# EAGLE design uproszczony_odbiornik (EAGLE 7.7.0)
Uproszczony odbiornik e-czas.pl
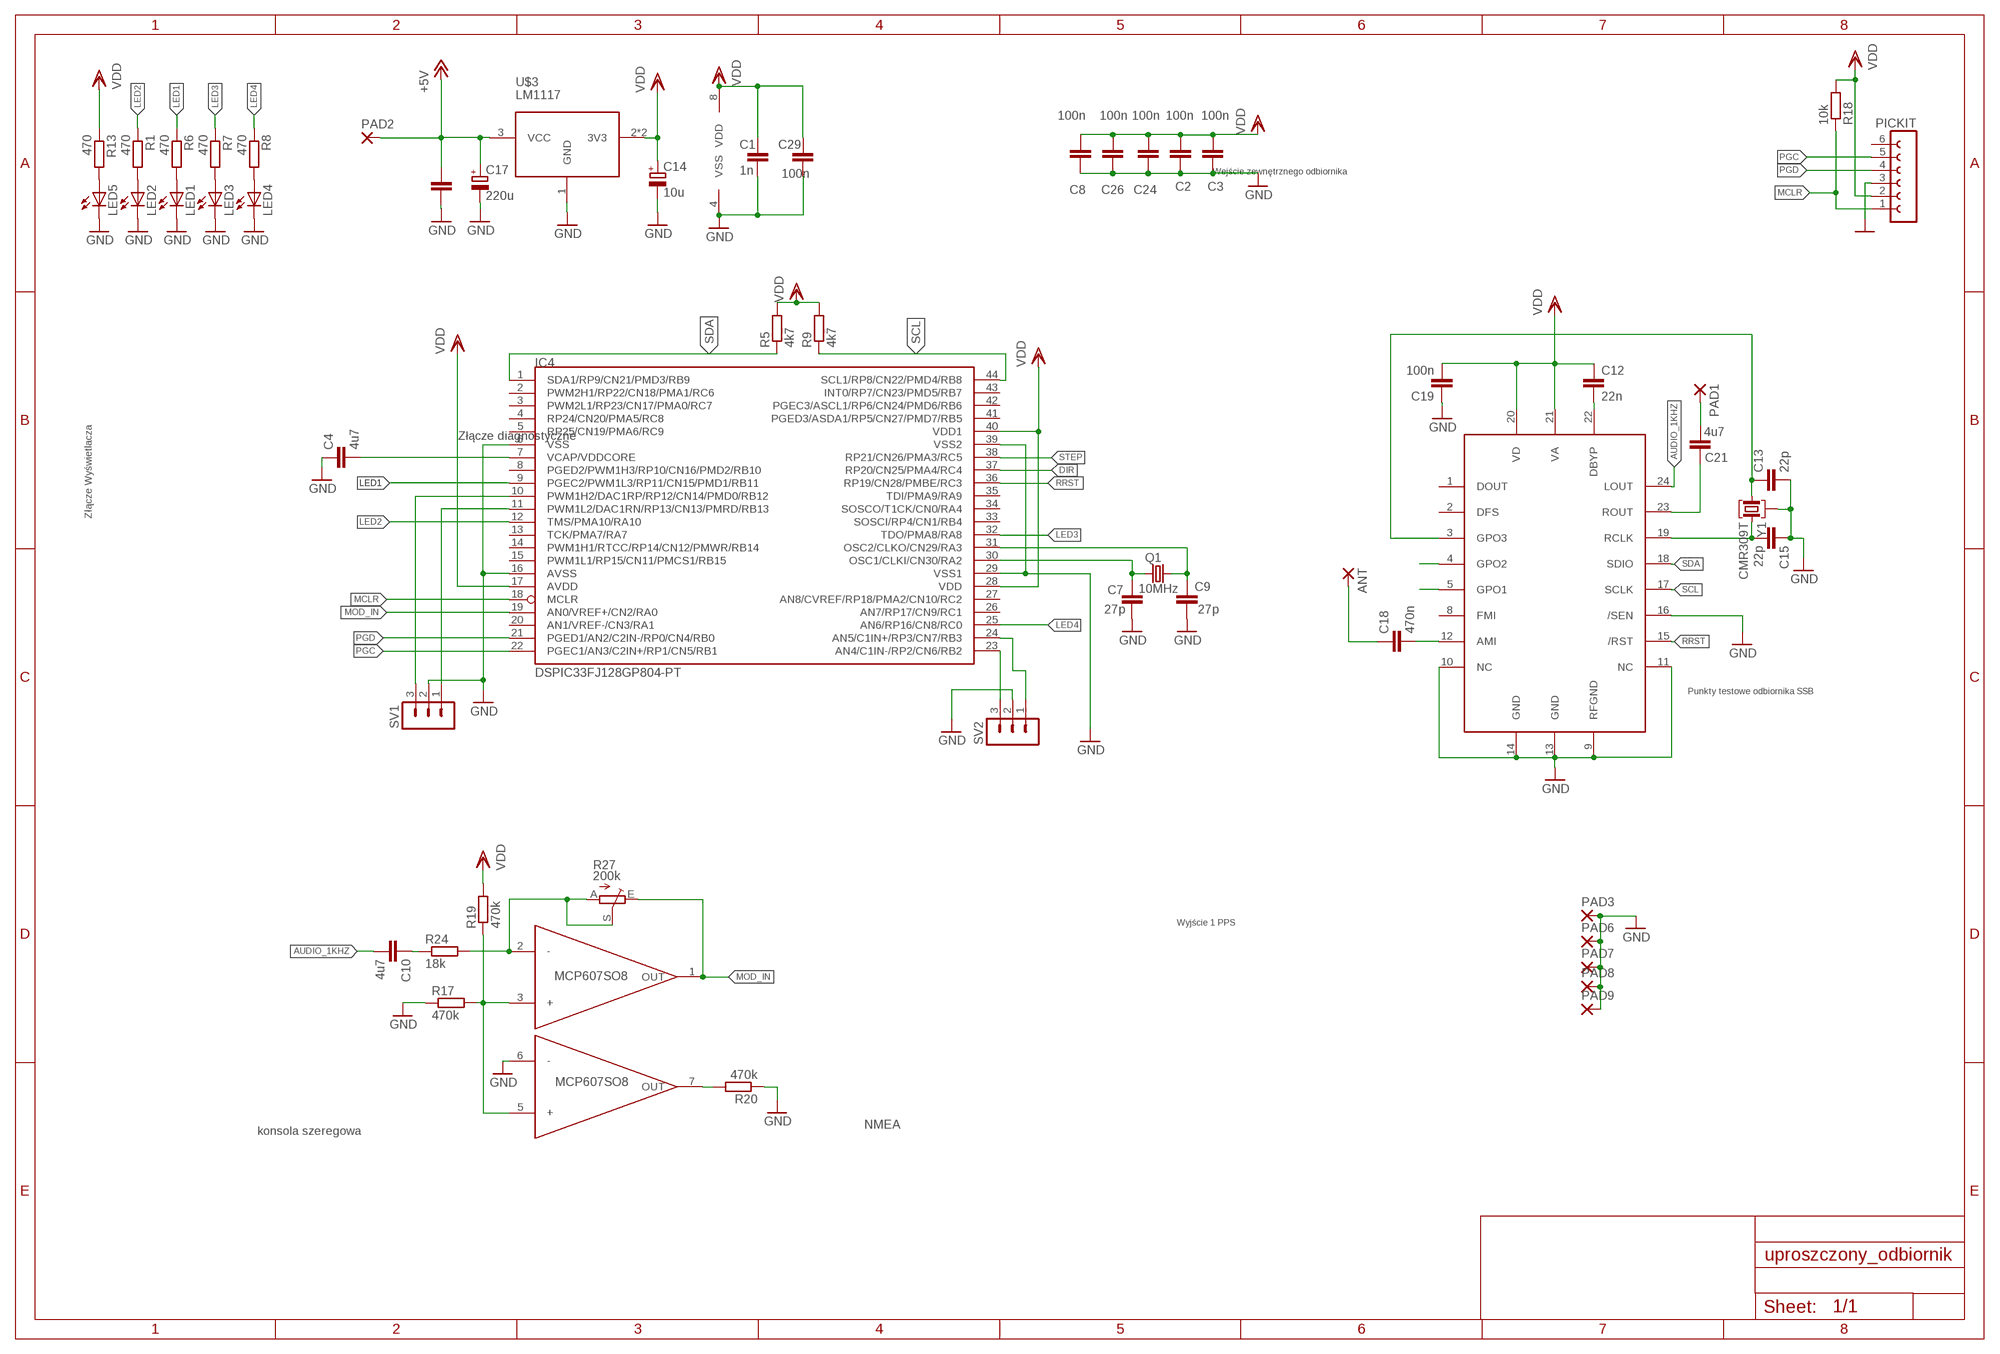
[diagram p0: schematic, sheet 1]
FRAME1 (A3L-LOC): AUTHOR: Tom SP9UOB

## Parts
ANT  1,6/0,9  [1,6/0,9]
C1  1n  C-EUC0805K  [C0805K]
C2  100n  C-EUC0805K  [C0805K]
C3  100n  C-EUC0805K  [C0805K]
C4  4u7  C-EUC0805K  [C0805K]
C5  100n  C-EUC0805K  [C0805K]
C7  27p  C-EUC0805K  [C0805K]
C8  100n  C-EUC0805K  [C0805K]
C9  27p  C-EUC0805K  [C0805K]
C10  4u7  C-EUC0603K  [C0603K]
C12  22n  C-EUC0603K  [C0603K]
C13  22p  C-EUC0603K  [C0603K]
C14  10u  CPOL-EUSMCB  [SMC_B]
C15  22p  C-EUC0603K  [C0603K]
C17  220u  CPOL-EUSMCB  [SMC_B]
C18  470n  C-EUC0603K  [C0603K]
C19  100n  C-EUC0603K  [C0603K]
C21  4u7  C-EUC0603K  [C0603K]
C24  100n  C-EUC0805K  [C0805K]
C26  100n  C-EUC0805K  [C0805K]
C29  100n  C-EUC0805K  [C0805K]
IC4  DSPIC33FJ128GP804-PT  DSPIC33FJ64MC804-PT  [TQFP44]
LED1  LEDCHIP-LED0805  [CHIP-LED0805]
LED2  LEDCHIP-LED0805  [CHIP-LED0805]
LED3  LEDCHIP-LED0805  [CHIP-LED0805]
LED4  LEDCHIP-LED0805  [CHIP-LED0805]
LED5  LEDCHIP-LED0805  [CHIP-LED0805]
PAD1  1,6/0,9  [1,6/0,9]
PAD2  1,6/0,9  [1,6/0,9]
PAD3  1,6/0,9  [1,6/0,9]
PAD6  1,6/0,9  [1,6/0,9]
PAD7  1,6/0,9  [1,6/0,9]
PAD8  1,6/0,9  [1,6/0,9]
PAD9  1,6/0,9  [1,6/0,9]
PICKIT  FE06-1  [FE06]
Q1  10MHz  CRYSTALHC49U-V  [HC49U-V]
R1  470  R-EU_R0805  [R0805]
R5  4k7  R-EU_R0805  [R0805]
R6  470  R-EU_R0805  [R0805]
R7  470  R-EU_R0805  [R0805]
R8  470  R-EU_R0805  [R0805]
R9  4k7  R-EU_R0805  [R0805]
R13  470  R-EU_R0805  [R0805]
R17  470k  R-EU_M0805  [M0805]
R18  10k  R-EU_R0805  [R0805]
R19  470k  R-EU_M0805  [M0805]
R20  470k  R-EU_M0805  [M0805]
R24  18k  R-EU_M0805  [M0805]
R27  200k  TRIM_EU-RJ9W  [RJ9W]
SV1  MA03-1  [MA03-1]
SV2  MA03-1  [MA03-1]
U$1  MCP607SO8  [SOIC8]
U$3  LM1117  [SOT223-3]
U$5  SI4735-D60  [SSOP24]
Y1  CMR309T  [CMR309T]

## Nets
10MHZ: C7.1 IC4.30(OSC1/CLKI/CN30/RA2) Q1.1
+5V: C5.1 C17.+ PAD2.1(P) U$3.3(VCC)
AUDIO_1KHZ: C10.2 U$5.24(LOUT)
CON_OUT: IC4.10(PWM1H2/DAC1RP/RP12/CN14/PMD0/RB12) SV1.3
CON_RX: IC4.11(PWM1L2/DAC1RN/RP13/CN13/PMRD/RB13) SV1.1
DBYP: C12.2 U$5.22(DBYP)
DIR: IC4.37(RP20/CN25/PMA4/RC4)
GND: C1.2 C2.2 C3.2 C4.1 C5.2 C7.2 C8.1 C9.2 C13.2 C14.- C15.1 C17.- C19.1 C24.1 C26.1 C29.2 IC4.6(VSS) IC4.16(AVSS) IC4.29(VSS1) IC4.39(VSS2) LED1.C LED2.C LED3.C LED4.C LED5.C PAD3.1(P) PAD6.1(P) PAD7.1(P) PAD8.1(P) PAD9.1(P) PICKIT.3 R17.1 R20.1 SV1.2 SV2.2 U$1.4(VSS) U$1.6(-) U$3.1(GND) U$5.9(RFGND) U$5.10(NC) U$5.11(NC) U$5.13(GND) U$5.14(GND) U$5.16(/SEN) Y1.3(G)
GPO1: U$5.5(GPO1)
GPO2: U$5.4(GPO2)
GPO3: C13.1 U$5.3(GPO3) Y1.1
LED1: IC4.9(PGEC2/PWM1L3/RP11/CN15/PMD1/RB11) R6.1
LED2: IC4.12(TMS/PMA10/RA10) R1.1
LED3: IC4.32(TDO/PMA8/RA8) R7.1
LED4: IC4.25(AN6/RP16/CN8/RC0) R8.1
MCLR: IC4.18(MCLR) PICKIT.1 R18.1
MOD_IN: IC4.19(AN0/VREF+/CN2/RA0) R27.E U$1.1(OUT)
N$1: LED2.A R1.2
N$2: R20.2 U$1.7(OUT)
N$3: C9.1 IC4.31(OSC2/CLKO/CN29/RA3) Q1.2
N$4: C21.2 PAD1.1(P)
N$6: ANT.1(P) C18.1
N$11: R17.2 R19.1 U$1.3(+) U$1.5(+)
N$12: R24.2 R27.A R27.S U$1.2(-)
N$17: LED3.A R7.2
N$18: LED4.A R8.2
N$19: LED1.A R6.2
N$20: C18.2 U$5.12(AMI)
N$45: C10.1 R24.1
N$47: LED5.A R13.2
NMEA_RX: IC4.23(AN4/C1IN-/RP2/CN6/RB2) SV2.3
NMEA_TX: IC4.24(AN5/C1IN+/RP3/CN7/RB3) SV2.1
PGC: IC4.22(PGEC1/AN3/C2IN+/RP1/CN5/RB1) PICKIT.5
PGD: IC4.21(PGED1/AN2/C2IN-/RP0/CN4/RB0) PICKIT.4
RCLK: C15.2 U$5.19(RCLK) Y1.2
ROUT: C21.1 U$5.23(ROUT)
RRST: IC4.36(RP19/CN28/PMBE/RC3) U$5.15(/RST)
SCL: IC4.44(SCL1/RP8/CN22/PMD4/RB8) R9.1 U$5.17(SCLK)
SDA: IC4.1(SDA1/RP9/CN21/PMD3/RB9) R5.1 U$5.18(SDIO)
STEP: IC4.38(RP21/CN26/PMA3/RC5)
VCAP/VDDCORE: C4.2 IC4.7(VCAP/VDDCORE)
VDD: C1.1 C2.1 C3.1 C8.2 C12.1 C14.+ C19.2 C24.2 C26.2 C29.1 IC4.17(AVDD) IC4.28(VDD) IC4.40(VDD1) PICKIT.2 R5.2 R9.2 R13.1 R18.2 R19.2 U$1.8(VDD) U$3.2(3V3) U$3.4(3V3) U$5.20(VD) U$5.21(VA)
Unconnected: IC4.2(PWM2H1/RP22/CN18/PMA1/RC6) IC4.3(PWM2L1/RP23/CN17/PMA0/RC7) IC4.4(RP24/CN20/PMA5/RC8) IC4.5(RP25/CN19/PMA6/RC9) IC4.8(PGED2/PWM1H3/RP10/CN16/PMD2/RB10) IC4.13(TCK/PMA7/RA7) IC4.14(PWM1H1/RTCC/RP14/CN12/PMWR/RB14) IC4.15(PWM1L1/RP15/CN11/PMCS1/RB15) IC4.20(AN1/VREF-/CN3/RA1) IC4.26(AN7/RP17/CN9/RC1) IC4.27(AN8/CVREF/RP18/PMA2/CN10/RC2) IC4.33(SOSCI/RP4/CN1/RB4) IC4.34(SOSCO/T1CK/CN0/RA4) IC4.35(TDI/PMA9/RA9) IC4.41(PGED3/ASDA1/RP5/CN27/PMD7/RB5) IC4.42(PGEC3/ASCL1/RP6/CN24/PMD6/RB6) IC4.43(INT0/RP7/CN23/PMD5/RB7) PICKIT.6 U$5.1(DOUT) U$5.2(DFS) U$5.8(FMI)

## Notes on the sheet
- Wejście zewnętrznego odbiornika
- Złącze diagnostyczne
- Złącze Wyświetlacza
- Punkty testowe odbiornika SSB
- Wyjście 1 PPS
- NMEA
- konsola szeregowa

## Library data of the parts
ANT PAD1-PAD3 PAD6-PAD9 = wirepad:1,6/0,9: THROUGH-HOLE PAD
C1-C5 C7-C10 C12 C13 C15 C18 C19 C21 C24 C26 C29 = rcl:C-EU: CAPACITOR, European symbol
C14 C17 = rcl:CPOL-EU: POLARIZED CAPACITOR, European symbol
IC4 = microchip-dspic33fjxxmc:DSPIC33FJ64MC804: dsPIC33FJ32MC302/304, dsPIC33FJ64MCX02/X04, AND dsPIC33FJ128MCX02/X04 High-Performance, 16-bit Digital Signal Controllers Package:44 Pin TQFP Operating Range: * Up to 40 MIPS operation (at 3.0V -3.6V): - Industrial temperature range (-40°C to +85°C) - Extended temperature range (-40°C to +125°C) High-Performance DSC CPU: * Modified Harvard architecture * C compiler optimized instruction set * 16-bit wide data path * 24-bit wide instructions * Linear program memory addressing up to 4M instruction words * Linear data memory addressing up to 64 Kbytes * 83 base instructions: mostly 1 word/1 cycle * Two 40-bit accumulators with rounding and saturation options * Flexible and powerful addressing modes: - Indirect - Modulo - Bit-Reversed * Software stack * 16 x 16 fractional/integer multiply operations * 32/16 and 16/16 divide operations * Single-cycle multiply and accumulate: - Accumulator write back for DSP operations - Dual data fetch * Up to ±16-bit shifts for up to 40-bit data Direct Memory Access (DMA): * 8-channel hardware DMA * Up to 2 Kbytes dual ported DMA buffer area (DMA RAM) to store data transferred via DMA: - Allows data transfer between RAM and a peripheral while CPU is executing code (no cycle stealing) * Most peripherals support DMA Timers/Capture/Compare/PWM: * Timer/Counters, up to five 16-bit timers: - Can pair up to make two 32-bit timers - One timer runs as a Real-Time Clock with an external 32.768 kHz oscillator - Programmable prescaler * Input Capture (up to four channels): - Capture on up, down or both edges - 16-bit capture input functions - 4-deep FIFO on each capture * Output Compare (up to four channels): - Single or Dual 16-bit Compare mode - 16-bit Glitchless PWM mode * Hardware Real-Time Clock/Calendar (RTCC): - Provides clock, calendar, and alarm functions Interrupt Controller: * 5-cycle latency * Up to 53 available interrupt sources * Up to three external interrupts * Seven programmable priority levels * Five processor exceptions Digital I/O: * Peripheral pin Select functionality * Up to 35 programmable digital I/O pins * Wake-up/Interrupt-on-Change for up to 31 pins * Output pins can drive from 3.0V to 3.6V * Up to 5V output with open drain configuration * All digital input pins are 5V tolerant * 4 mA sink on all I/O pins On-Chip Flash and SRAM: * Flash program memory (up to 128 Kbytes) * Data SRAM (up to 16 Kbytes) * Boot, Secure, and General Security for program Flash System Management: * Flexible clock options: - External, crystal, resonator, internal RC - Fully integrated Phase-Locked Loop (PLL) - Extremely low jitter PLL * Power-up Timer * Oscillator Start-up Timer/Stabilizer * Watchdog Timer with its own RC oscillator * Fail-Safe Clock Monitor * Reset by multiple sources Power Management: * On-chip 2.5V voltage regulator * Switch between clock sources in real time * Idle, Sleep, and Doze modes with fast wake-up Analog-to-Digital Converters (ADCs): * 10-bit, 1.1 Msps or 12-bit, 500 Ksps conversion: - Two and four simultaneous samples (10-bit ADC) - Up to nine input channels with auto-scanning - Conversion start can be manual or synchronized with one of four trigger sources - Conversion possible in Sleep mode - ±2 LSb max integral nonlinearity - ±1 LSb max differential nonlinearity Audio Digital-to-Analog Converter (DAC): - 16-bit Dual Channel DAC module - 100 Ksps maximum sampling rate - Second-Order Digital Delta-Sigma Modulator Comparator Module: * Two analog comparators with programmable input/output configuration CMOS Flash Technology: * Low-power, high-speed Flash technology * Fully static design * 3.3V (±10%) operating voltage * Industrial and Extended temperature * Low power consumption Motor Control Peripherals: * 6-channel 16-bit Motor Control PWM: - Three duty cycle generators - Independent or Complementary mode - Programmable dead-time and output polarity - Edge-aligned or center-aligned - Manual output override control - One Fault input - Trigger for ADC conversions - PWM frequency for 16-bit resolution (@ 40 MIPS) = 1220 Hz for Edge-Aligned mode, 610 Hz for Center-Aligned mode - PWM frequency for 11-bit resolution (@ 40 MIPS) = 39.1 kHz for Edge-Aligned mode, 19.55 kHz for Center-Aligned mode * 2-channel 16-bit Motor Control PWM: - One duty cycle generator - Independent or Complementary mode - Programmable dead time and output polarity - Edge-aligned or center-aligned - Manual output override control - One Fault input - Trigger for ADC conversions - PWM frequency for 16-bit resolution (@ 40 MIPS) = 1220 Hz for Edge-Aligned mode, 610 Hz for Center-Aligned mode - PWM frequency for 11-bit resolution (@ 40 MIPS) = 39.1 kHz for Edge-Aligned mode, 19.55 kHz for Center-Aligned mode * 2-Quadrature Encoder Interface module: - Phase A, Phase B, and index pulse input - 16-bit up/down position counter - Count direction status - Position Measurement (x2 and x4) mode - Programmable digital noise filters on inputs - Alternate 16-bit Timer/Counter mode - Interrupt on position counter rollover/underflow
LED1-LED5 = led:LED: LED OSRAM: - CHIPLED LG R971, LG N971, LY N971, LG Q971, LY Q971, LO R971, LY R971 LH N974, LH R974 LS Q976, LO Q976, LY Q976 LO Q996 - Hyper CHIPLED LW Q18S LB Q993, LB Q99A, LB R99A - SideLED LS A670, LO A670, LY A670, LG A670, LP A670 LB A673, LV A673, LT A673, LW A673 LH A674 LY A675 LS A676, LA A676, LO A676, LY A676, LW A676 LS A679, LY A679, LG A679 - Hyper Micro SIDELED® LS Y876, LA Y876, LO Y876, LY Y876 LT Y87S - SmartLED LW L88C, LW L88S LB L89C, LB L89S, LG L890 LS L89K, LO L89K, LY L89K LS L896, LA L896, LO L896, LY L896 - TOPLED LS T670, LO T670, LY T670, LG T670, LP T670 LSG T670, LSP T670, LSY T670, LOP T670, LYG T670 LG T671, LOG T671, LSG T671 LB T673, LV T673, LT T673, LW T673 LH T674 LS T676, LA T676, LO T676, LY T676, LB T676, LH T676, LSB T676, LW T676 LB T67C, LV T67C, LT T67C, LS T67K, LO T67K, LY T67K, LW E67C LS E67B, LA E67B, LO E67B, LY E67B, LB E67C, LV E67C, LT E67C LW T67C LS T679, LY T679, LG T679 LS T770, LO T770, LY T770, LG T770, LP T770 LB T773, LV T773, LT T773, LW T773 LH T774 LS E675, LA E675, LY E675, LS T675 LS T776, LA T776, LO T776, LY T776, LB T776 LHGB T686 LT T68C, LB T68C - Hyper Mini TOPLED® LB M676 - Mini TOPLED Santana® LG M470 LS M47K, LO M47K, LY M47K Source: http://www.osram.convergy.de LUXEON: - LUMILED® LXK2-PW12-R00, LXK2-PW12-S00, LXK2-PW14-U00, LXK2-PW14-V00 LXK2-PM12-R00, LXK2-PM12-S00, LXK2-PM14-U00 LXK2-PE12-Q00, LXK2-PE12-R00, LXK2-PE12-S00, LXK2-PE14-T00, LXK2-PE14-U00 LXK2-PB12-K00, LXK2-PB12-L00, LXK2-PB12-M00, LXK2-PB14-N00, LXK2-PB14-P00, LXK2-PB14-Q00 LXK2-PR12-L00, LXK2-PR12-M00, LXK2-PR14-Q00, LXK2-PR14-R00 LXK2-PD12-Q00, LXK2-PD12-R00, LXK2-PD12-S00 LXK2-PH12-R00, LXK2-PH12-S00 LXK2-PL12-P00, LXK2-PL12-Q00, LXK2-PL12-R00 Source: www.luxeon.com KINGBRIGHT: KA-3528ASYC Source: www.kingbright.com
PICKIT = con-lsta:FE06-1: FEMALE HEADER; OC_FARNELL: unknown; OC_NEWARK: unknown
Q1 = crystal:CRYSTAL: CRYSTAL; OC_FARNELL: 1666969; OC_NEWARK: unknown
R1 R5-R9 R13 R17-R20 R24 = rcl:R-EU_: RESISTOR, European symbol
R27 = pot:TRIM_EU-: POTENTIOMETER
SV1 SV2 = con-lstb:MA03-1: PIN HEADER; OC_FARNELL: unknown; OC_NEWARK: unknown
U$1 = vx:MCP607
U$3 = vx:LM1117
U$5 = vx:SI4735-D60
Y1 = crystal:CMR309T: CRYSTAL Citizen CMR309T Series

## Board
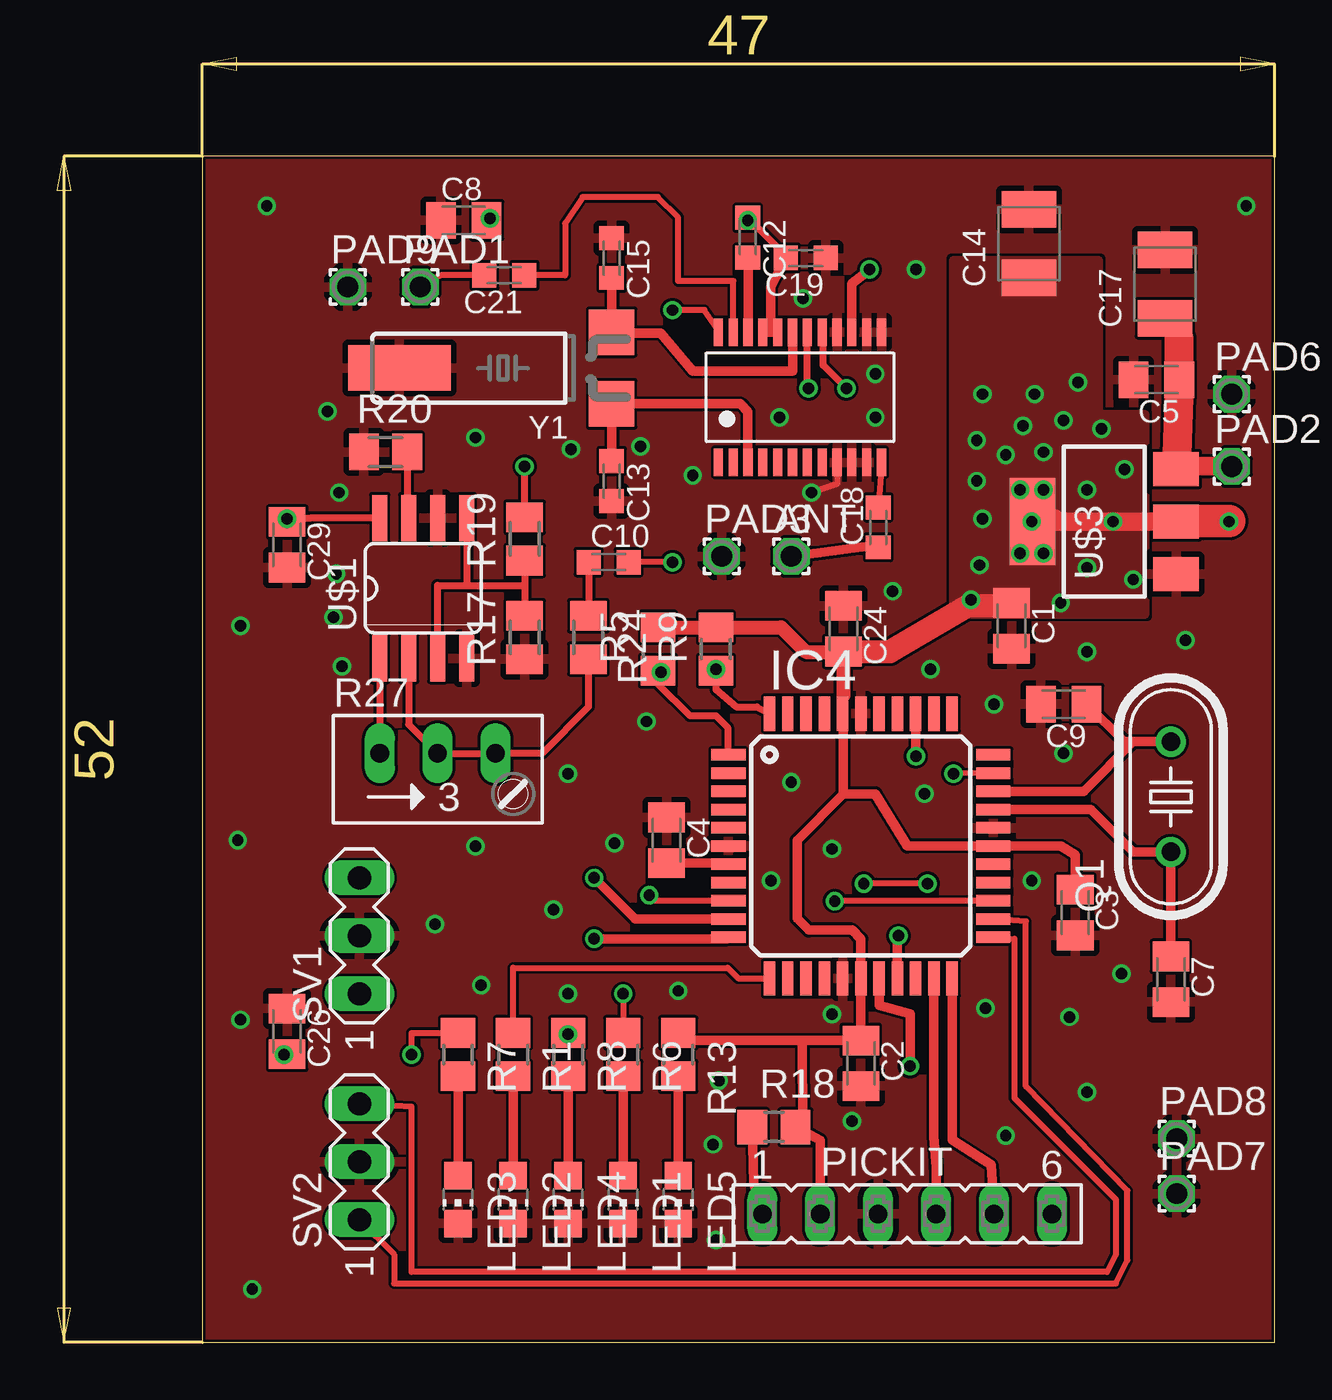
[diagram p1: board, top side]
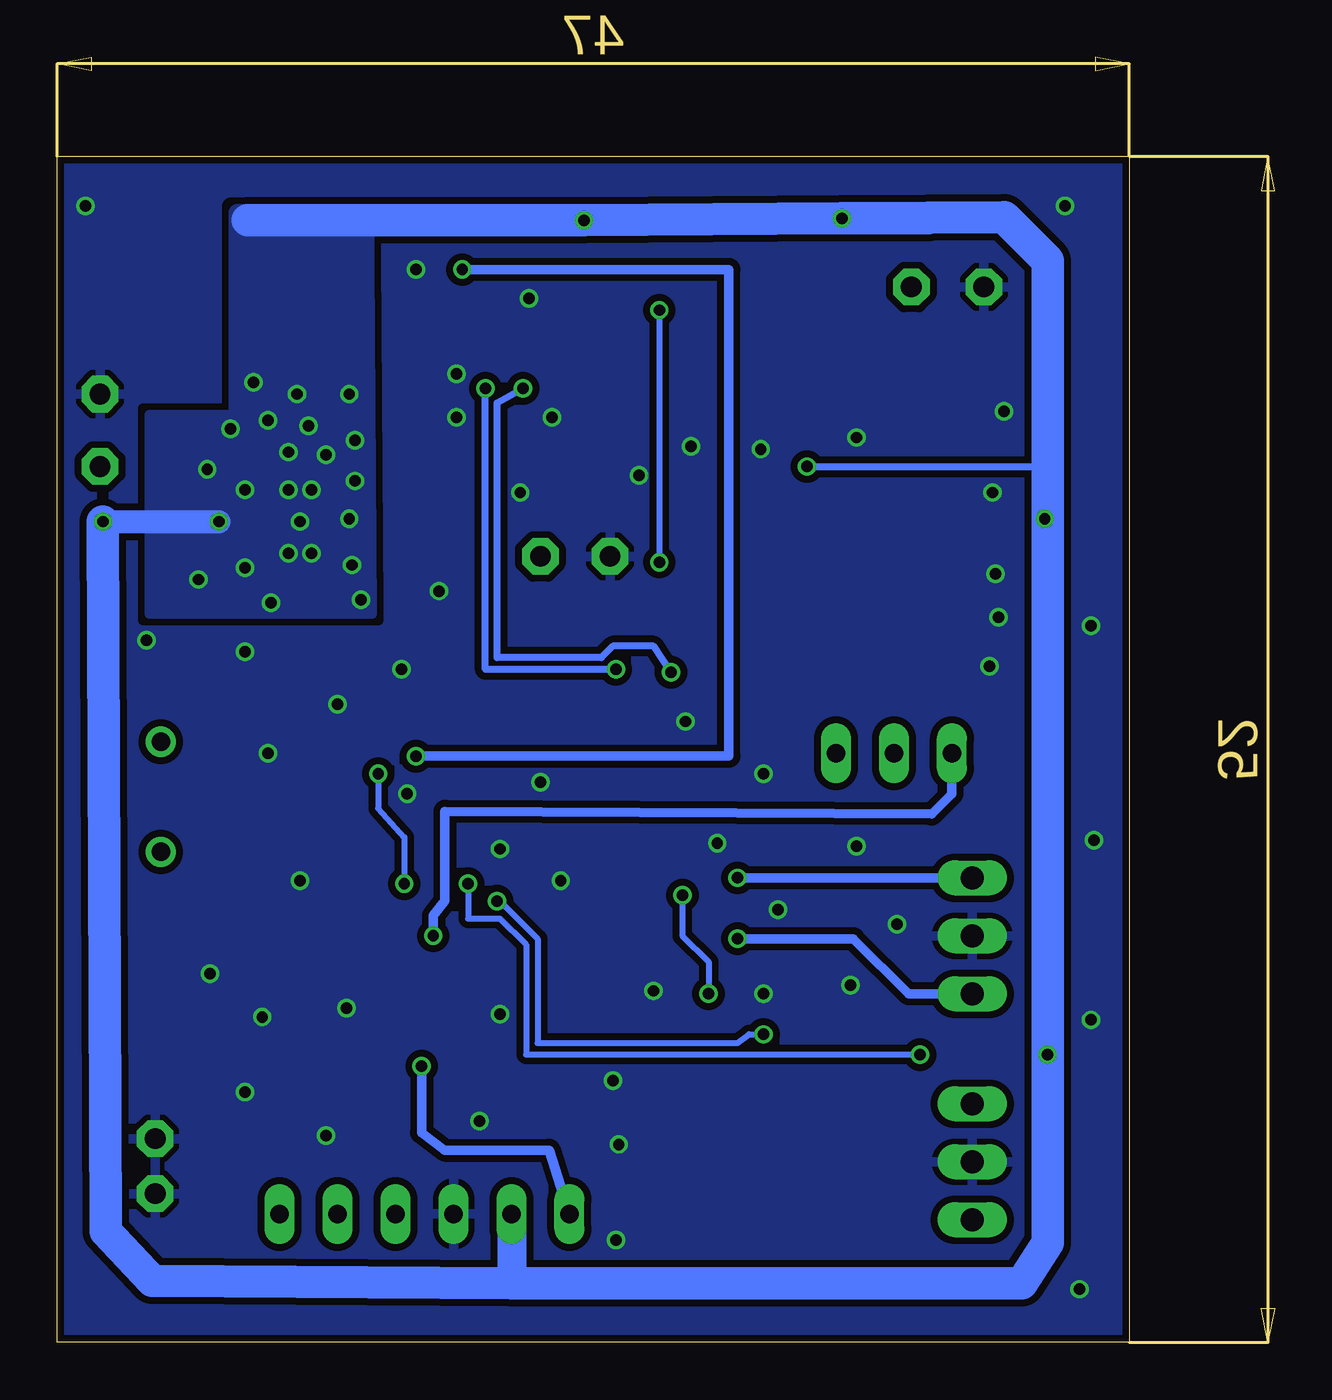
[diagram p2: board, bottom side, seen from below]

Size 47 x 52 mm. Coordinates in mm from the lower left corner, seen from the top.
Outline: 0,0 47,0 47,52 0,52 0,0
Copper layers (1*16): Top 0.035mm / dielectric 1.5mm / Bottom 0.035mm
Design rules "jlcpcb": minimum track width 5mil, minimum drill 0.25mm, track to track 5mil, track to pad 5mil, pad to pad 5mil, via to via 5mil, smd to smd 0mil, copper to edge 5mil, drill to drill 6mil, minimum pad ring 10mil, minimum via ring 6mil, stop-mask expansion 2mil, vias tented up to drill 100mil, thermal gap 10mil

### Footprints (pad centres in the part's own frame; a part is rotated, then mirrored left to right if it is on the bottom)
1,6/0,9 = drill 0.914 pad 1.6 octagon: 1 0,0
C0805K = smd 1.3 x 1.6: 1 -1,0; 2 1,0
C0603K = smd 1.05 x 1.08: 1 -0.875,0; 2 0.875,0
SMC_B = smd 1.6 x 2.4: + -1.5,0; - 1.5,0
TQFP44 = smd 1.5 x 0.5: 1 -5.8,4; 2 -5.8,3.2; 3 -5.8,2.4; 4 -5.8,1.6; 5 -5.8,0.8; 6 -5.8,0; 7 -5.8,-0.8; 8 -5.8,-1.6; 9 -5.8,-2.4; 10 -5.8,-3.2; 11 -5.8,-4; 23 5.8,-4; 24 5.8,-3.2; 25 5.8,-2.4; 26 5.8,-1.6; 27 5.8,-0.8; 28 5.8,0; 29 5.8,0.8; 30 5.8,1.6; 31 5.8,2.4; 32 5.8,3.2; 33 5.8,4 | smd 0.5 x 1.5: 12 -4,-5.8; 13 -3.2,-5.8; 14 -2.4,-5.8; 15 -1.6,-5.8; 16 -0.8,-5.8; 17 0,-5.8; 18 0.8,-5.8; 19 1.6,-5.8; 20 2.4,-5.8; 21 3.2,-5.8; 22 4,-5.8; 34 4,5.8; 35 3.2,5.8; 36 2.4,5.8; 37 1.6,5.8; 38 0.8,5.8; 39 0,5.8; 40 -0.8,5.8; 41 -1.6,5.8; 42 -2.4,5.8; 43 -3.2,5.8; 44 -4,5.8
CHIP-LED0805 = smd 1.2 x 1.2: A 0,-1.05; C 0,1.05
FE06 = drill 0.813 long: 1 -6.35,0; 2 -3.81,0; 3 -1.27,0; 4 1.27,0; 5 3.81,0; 6 6.35,0
HC49U-V = drill 0.813: 1 -2.413,0; 2 2.413,0
R0805 = smd 1.3 x 1.5: 1 -0.95,0; 2 0.95,0
M0805 = smd 1.3 x 1.6: 1 -0.95,0; 2 0.95,0
RJ9W = drill 0.813 long: A 2.54,0.635; E -2.54,0.635; S 0,0.635
MA03-1 = drill 1.016 long: 1 -2.54,0; 2 0,0; 3 2.54,0
SOIC8 = smd 0.66 x 2.032: 1 -3.175,-3.073; 2 -1.905,-3.073; 3 -0.635,-3.073; 4 0.635,-3.073; 5 0.635,3.073; 6 -0.635,3.073; 7 -1.905,3.073; 8 -3.175,3.073
SOT223-3 = smd 1.5 x 2: 1 -2.3,-3.15; 2 0,-3.15; 3 2.3,-3.15 | smd 3.8 x 2: 4 0,3.15
SSOP24 = smd 0.4 x 1.2: 1 -3.575,-3.5; 2 -2.925,-3.5; 3 -2.275,-3.5; 4 -1.625,-3.5; 5 -0.975,-3.5; 6 -0.325,-3.5; 7 0.325,-3.5; 8 0.975,-3.5; 9 1.625,-3.5; 10 2.275,-3.5; 11 2.925,-3.5; 12 3.575,-3.5; 13 3.575,2.2; 14 2.925,2.2; 15 2.275,2.2; 16 1.625,2.2; 17 0.975,2.2; 18 0.325,2.2; 19 -0.325,2.2; 20 -0.975,2.2; 21 -1.625,2.2; 22 -2.275,2.2; 23 -2.925,2.2; 24 -3.575,2.2
CMR309T = smd 2 x 2: 1 -1.57,0; 2 1.57,0 | smd 2 x 4.5: 3 0,9.3

### Placement (x,y rotation side)
ANT  25.81,34.47 0 top
C1  35.47,31.42 270 top
C2  28.86,12.24 270 top
C3  38.26,18.84 270 top
C4  20.35,22.02 270 top
C5  41.81,42.21 180 top
C7  42.45,15.92 270 top
C8  11.46,49.2 0 top
C9  37.75,27.99 180 top
C10  17.81,34.21 0 top
C12  23.91,48.44 270 top
C13  17.94,37.77 270 top
C14  36.23,48.18 90 top
C15  17.94,47.55 270 top
C17  42.2,46.4 90 top
C18  29.62,35.73 90 top
C19  26.45,47.55 180 top
C21  13.24,46.78 180 top
C24  28.1,31.29 270 top
C26  3.71,13.64 270 top
C29  3.71,34.97 270 top
IC4  28.86,21.77 0 top
LED1  18.45,6.27 180 top
LED2  13.62,6.27 180 top
LED3  11.21,6.27 180 top
LED4  16.03,6.27 180 top
LED5  20.86,6.27 180 top
PAD1  9.56,46.28 0 top
PAD2  45.12,38.4 0 top
PAD3  22.77,34.47 0 top
PAD6  45.12,41.58 0 top
PAD7  42.7,6.53 0 top
PAD8  42.7,8.94 0 top
PAD9  6.38,46.28 0 top
PICKIT  30.89,5.64 0 top
Q1  42.45,23.92 90 top
R1  13.62,12.62 270 top
R5  19.97,30.4 90 top
R6  18.45,12.62 270 top
R7  11.21,12.62 270 top
R8  16.03,12.62 270 top
R9  22.51,30.4 90 top
R13  20.86,12.62 270 top
R17  14.13,30.91 90 top
R18  25.05,9.45 0 top
R19  14.13,35.23 90 top
R20  8.03,39.04 0 top
R24  16.92,30.91 270 top
R27  10.32,25.19 0 top
SV1  6.89,17.83 90 top
SV2  6.89,7.92 90 top
U$1  10.95,33.07 0 top
U$3  39.53,35.99 90 top
U$5  26.19,42.09 0 top
Y1  17.94,42.72 90 top

### Tracks (layer width: path | path; a pad name or v marks a point on that pad's centre or on a via)
10MHZ
  Top 0.406: IC4.30 38.95,23.36 40.8,21.51 Q1.1 C7.1
+5V
  Top 0.813: C5.1 42.81,42.08 | U$3.3 42.82,38.43 45.09,38.43 PAD2.1 | 42.81,44.03 C17.+
  Top 1.27: 42.81,42.08 U$3.3 | C5.1 42.81,44.03
AUDIO_1KHZ  (via drill 0.5)
  Top 0.254: U$5.24 22.62,44.37 22,45.26 v20.61,45.26 | v20.61,34.21 C10.2
  Bottom 0.254: v20.61,45.26 v20.61,34.21
CON_OUT  (via drill 0.5)
  Top 0.406: v17.18,20.37 18.98,18.57 IC4.10
  Bottom 0.406: SV1.3 v17.18,20.37
CON_RX  (via drill 0.5)
  Top 0.406: v17.18,17.7 23,17.7 IC4.11
  Bottom 0.406: SV1.1 9.68,15.29 12.1,17.7 v17.18,17.7
DBYP
  Top 0.406: U$5.22 23.92,47.55 C12.2
GND  (via drill 0.5)
  Top 0.254: U$5.9 27.82,37.64 v26.7,37.26
  other vias: 38.77,10.97 11.97,39.67 2.83,49.83 43.09,30.78 31.27,47.04 38.77,30.27 19.46,27.23 21.5,38.02 34.7,27.99 36.35,20.24 34.32,14.65 24.92,20.24 27.59,21.64 31.66,24.05 25.81,24.56 16.16,39.16 16.03,24.94 40.29,16.18 38.01,14.27 45.75,49.83 2.19,2.33 1.56,22.02 11.97,21.77 18.07,21.89 35.21,9.06 37.75,25.83 6.13,29.64 5.87,33.7 6,37.26 5.49,40.81 10.19,18.34 15.4,18.97 20.86,15.41 16.03,15.29 12.22,15.67 31.91,29.51 28.48,9.7 22.38,8.68 1.68,31.42 5.75,31.8 1.68,14.14 30.26,32.94 26.32,45.77 25.3,40.56 29.5,40.56 29.5,42.47 19.21,39.29 27.59,14.4 22.64,11.48 22.51,4.49
  pour Bottom (isolate 0.305, rank 6): -2.51,55.8 49.56,54.28 48.67,-1.35 -3.14,-1.6
  pour Top (rank 6): 53.37,57.45 52.61,57.07 50.83,-6.43 -4.29,-5.16 -3.27,58.34
GPO3
  Top 0.406: U$5.3 23.91,38.6 23.91,40.81 23.57,41.15 Y1.1 C13.1
LED1  (via drill 0.5)
  Top 0.254: IC4.9 19.83,19.36 v19.59,19.61 | v18.45,15.29 R6.1
  Bottom 0.254: v19.59,19.61 19.59,17.83 18.45,16.68 v18.45,15.29
LED2
  Top 0.254: R1.1 13.62,16.43 23.02,16.43 23.48,15.96 IC4.12
LED3  (via drill 0.5)
  Top 0.254: IC4.32 v32.92,24.94 | v31.78,20.11 v28.99,20.11 | v9.18,12.62 9.18,13.57 R7.1
  Bottom 0.254: v32.92,24.94 32.92,23.42 31.78,22.15 v31.78,20.11 | v28.99,20.11 28.99,18.59 27.59,18.59 26.45,17.45 26.45,12.62 v9.18,12.62
LED4  (via drill 0.5)
  Top 0.254: IC4.25 34.66,19.35 v27.72,19.35 | v16.03,13.51 R8.1
  Bottom 0.254: v27.72,19.35 27.46,19.23 25.94,17.7 25.94,13.13 17.18,13.13 16.67,13.51 v16.03,13.51
MCLR  (via drill 0.5)
  Top 0.406: IC4.18 29.66,14.78 31.02,14.4 v31.02,12.11 | R18.1 24.16,6.97 PICKIT.1
  Bottom 0.406: v31.02,12.11 31.02,9.19 30,8.43 25.43,8.43 PICKIT.1
MOD_IN  (via drill 0.5)
  Top 0.305: U$1.1 R27.E
  Top 0.406: v30.51,17.83 30.46,17.83 IC4.19
  Bottom 0.406: R27.E 7.78,24.05 8.67,23.16 30,23.29 30,19.35 30.51,18.72 v30.51,17.83
N$1
  Top 0.406: R1.2 LED2.A
N$2
  Top 0.305: R20.2 8.98,36.21 U$1.7
N$3
  Top 0.406: IC4.31 38.63,24.16 40.8,26.34 | 40.8,26.34 Q1.2 | C9.1 40.4,26.34 40.8,26.34
N$4
  Top 0.254: C21.2 10.45,46.78 9.3,46.28 PAD1.1
N$6
  Top 0.406: ANT.1 28.73,34.85 arc-20 C18.1
N$11
  Top 0.305: R19.1 14.13,33.2 | 14.13,33.2 R17.2 | U$1.3 10.32,33.2 11.59,33.2 | 11.59,33.2 14.13,33.2 | U$1.5 11.59,33.2
N$12
  Top 0.305: U$1.2 9.05,27.1 R27.S R27.A 14.89,25.83 16.92,27.86 R24.2
N$17
  Top 0.406: R7.2 LED3.A
N$18
  Top 0.406: R8.2 LED4.A
N$19
  Top 0.406: R6.2 LED1.A
N$20
  Top 0.254: U$5.12 29.77,38.54 C18.2
N$45
  Top 0.305: C10.1 16.94,31.87 R24.1
N$47
  Top 0.406: R13.2 LED5.A
NMEA_RX
  Top 0.254: IC4.23 34.66,17.74 35.59,17.7 35.59,10.72 40.04,6.27 40.04,3.86 39.66,3.1 9.18,3.1 9.18,10.34 SV2.3
NMEA_TX
  Top 0.254: SV2.1 8.41,3.86 8.41,2.59 40.04,2.59 40.55,3.6 40.55,6.65 36.1,11.22 36.1,18.46 IC4.24
PGC
  Top 0.406: IC4.22 32.86,8.88 34.58,7.79 PICKIT.5
PGD
  Top 0.406: IC4.21 32.06,9.04 32.16,7.67 PICKIT.4
RCLK
  Top 0.406: U$5.19 25.88,42.59 21.5,42.59 20.1,44.24 17.98,44.24 Y1.2 C15.2
ROUT
  Top 0.254: U$5.23 23.27,46.53 20.86,46.53 20.86,49.32 19.97,50.21 16.67,50.21 15.91,49.07 15.91,46.78 C21.1
RRST  (via drill 0.5)
  Top 0.406: IC4.36 31.27,27.57 v31.27,25.7 | v29.24,47.04 28.47,46.41 U$5.15
  Bottom 0.406: v31.27,25.7 17.56,25.7 17.56,47.04 v29.24,47.04
SCL  (via drill 0.5)
  Top 0.305: IC4.44 24.31,27.86 23.4,27.86 22.51,28.62 R9.1 22.57,29.51 v22.51,29.51 | v28.23,41.83 27.21,42.85 27.21,44.24 U$5.17
  Bottom 0.305: v22.51,29.51 28.23,29.51 v28.23,41.83
SDA  (via drill 0.5)
  Top 0.305: IC4.1 23.02,25.81 23.02,26.97 22.51,27.48 21.37,27.48 19.97,28.88 R5.1 19.91,29.26 v20.1,29.38 | v26.57,41.83 26.52,41.89 U$5.18
  Bottom 0.305: v20.1,29.38 20.86,30.53 22.64,30.53 23.15,30.02 27.72,30.02 27.72,41.2 v26.57,41.83
VCAP/VDDCORE
  Top 0.406: C4.2 23.06,21.02 IC4.7
VDD  (via drill 0.5)
  Top 0.305: R19.2 v14.13,38.4 | U$1.8 4.73,36.14 | 4.73,36.14 v3.71,36.12 | C29.1 3.71,36.14 4.73,36.14 | C12.1 23.89,49.32 v23.91,49.2 C12.1 | C19.2 25.56,47.66 C12.1
  Top 0.406: U$5.21 U$5.20 arc-90 24.92,44.58 24.92,46.29 C19.2 | C12.1 v23.91,49.21 | C3.1 38.26,21.38 37.62,21.77 IC4.28 30.89,21.77 29.5,24.05 28.1,24.05 | 28.1,28.37 IC4.40 28.1,27.53 28.1,24.05 | PICKIT.2 27.08,8.87 R18.2 | C26.2 3.59,12.89 v3.59,12.62 | 28.1,24.05 26.07,22.02 26.07,18.59 26.57,18.08 28.48,18.08 28.86,17.7 IC4.17 C2.1 26.28,13.24 | R13.1 21.19,13.24 26.28,13.24 | 26.28,13.24 26.32,9.45 26.32,9.19
  Top 0.61: R5.2 R9.2 25.37,31.35 26.45,30.27 28.08,30.27 C24.2 28.1,28.37
  Top 0.813: U$3.2 37.5,35.99 37.37,36.12 | 45.02,36.02 v44.99,35.99 | C8.2 v12.6,49.28
  Top 1.016: U$3.2 42.82,36.02 43.31,36.12 43.21,36.12 | C24.2 30.13,30.29 33.56,32.31 35.47,32.31 C1.1
  Top 1.422: 42.82,36.02 45.02,36.02
  Bottom 0.305: v14.13,38.4 3.59,38.4 | v3.71,36.12 3.59,36.12
  Bottom 0.813: 8.81,49.29 8.79,49.3 | v12.6,49.28 10.32,49.29
  Bottom 1.016: v44.99,35.99 v39.91,35.99
  Bottom 1.27: PICKIT.2 27.08,2.59
  Bottom 1.422: 38.64,49.2 v23.91,49.2 v12.6,49.28 10.83,49.29 10.32,49.29 8.81,49.29 | 8.79,49.3 5.49,49.32 3.59,47.42 3.59,38.4 3.59,36.12 v3.59,12.62 3.59,4.37 4.73,2.59 27.08,2.59 42.83,2.71 44.86,4.87 v44.99,35.99
  other vias: 36.86,37.39 35.85,37.39 35.85,34.59 36.86,34.59 35.97,40.18 37.75,40.43 34.2,36.12 33.94,37.77 34.07,34.08 38.77,37.39 36.35,35.99 35.21,38.91 36.86,39.04 33.94,39.55 38.77,33.96 37.62,32.43 40.42,38.27 39.4,40.05 40.8,33.45 34.2,41.58 36.48,41.58 38.39,42.09 33.69,32.56
  pour Top (isolate 0.406, no thermals): 32.92,47.42 39.27,47.42 39.27,40.69 41.31,40.69 41.31,31.92 32.92,31.92
  pour Bottom (no thermals): 33.31,47.29 33.31,49.7 39.15,49.7 arc-90 39.27,49.32 39.27,40.69 42.96,40.69 42.96,31.92 33.18,31.92